# EAGLE schematic bq32000 (EAGLE 6.4)
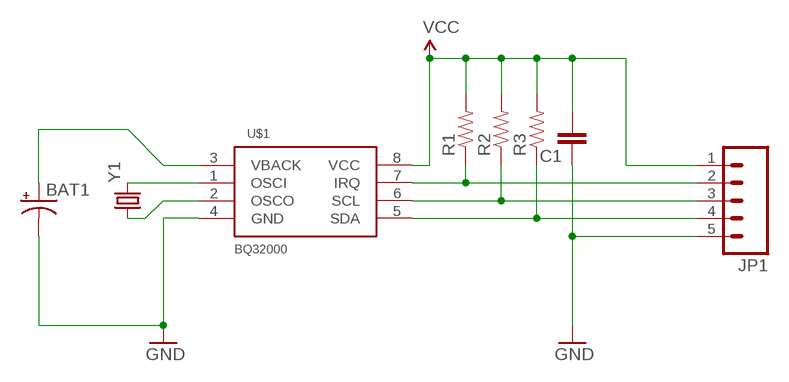
[diagram p0: schematic, sheet 1]

## Parts
BAT1  CAP_POLPTH3  [CPOL-RADIAL-1000UF-63V]
C1  CAP0805  [0805]
JP1  M05LOCK  [1X05_LOCK]
R1  RESISTOR0805-RES  [0805]
R2  RESISTOR0805-RES  [0805]
R3  RESISTOR0805-RES  [0805]
U$1  BQ32000  [SO08]
Y1  CRYSTAL32-SMD  [CRYSTAL-32KHZ-SMD]

## Nets
GND: BAT1.2(-) C1.1 JP1.5 U$1.4(GND)
N$1: BAT1.1(+) U$1.3(VBACK)
N$2: JP1.2 R1.1 U$1.7(IRQ)
N$3: JP1.3 R2.1 U$1.6(SCL)
N$4: JP1.4 R3.1 U$1.5(SDA)
N$5: U$1.1(OSCI) Y1.X2
N$6: U$1.2(OSCO) Y1.X1
VCC: C1.2 JP1.1 R1.2 R2.2 R3.2 U$1.8(VCC)

## Library data of the parts
BAT1 = SparkFun-Capacitors:CAP_POL: Capacitor Polarized These are standard SMD and PTH capacitors. Normally 10uF, 47uF, and 100uF in electrolytic and tantalum varieties. Always verify the external diameter of the through hole cap, it varies with capacity, voltage, and manufacturer. The EIA devices should be standard.
C1 = SparkFun-Passives:CAP: Capacitor Standard 0603 ceramic capacitor, and 0.1" leaded capacitor.
JP1 = SparkFun-Connectors:M05: Header 5 Standard 5-pin 0.1" header. Use with straight break away headers (SKU : PRT-00116), right angle break away headers (PRT-00553), swiss pins (PRT-00743), machine pins (PRT-00117), and female headers (PRT-00115). Molex polarized connector foot print use with SKU : PRT-08230 with associated crimp pins and housings.
R1-R3 = SparkFun-Passives:RESISTOR: Resistor Basic schematic elements and footprints for 0603, 1206, and PTH resistors.
U$1 = custom:BQ32000
Y1 = SparkFun-FreqCtrl:CRYSTAL: Various standard crystals. Proven footprints. Spark Fun Electronics SKU : COM-00534